# EAGLE schematic eagle 1 (EAGLE 9.2.0)
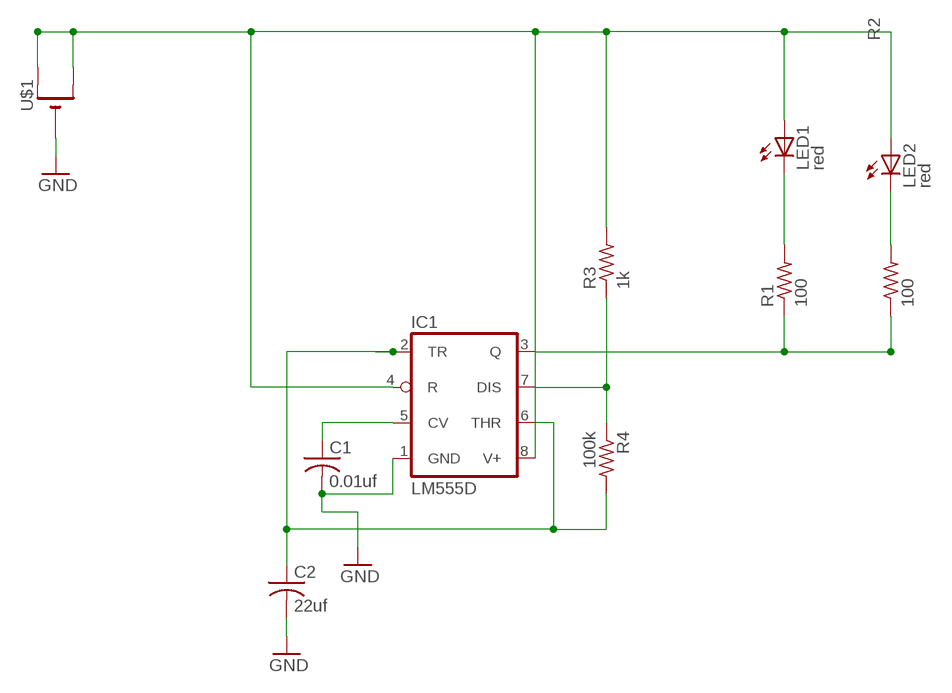
[diagram p0: schematic, sheet 1]

## Parts
C1  0.01uf  C-USC0805  [C0805]
C2  22uf  C-USC0805  [C0805]
IC1  LM555D  [SO08]
LED1  red  LEDCHIPLED_0805  [CHIPLED_0805]
LED2  red  LEDCHIPLED_0805  [CHIPLED_0805]
R1  100  R-US_R0805  [R0805]
R2  100  R-US_R0805  [R0805]
R3  1k  R-US_R0805  [R0805]
R4  100k  R-US_R0805  [R0805]
U$1  CR1220SMT  [CR1220-SMD]

## Nets
GND: C1.2 C2.2 IC1.1(GND) U$1.-
N$1: LED1.C R1.2
N$2: LED2.C R2.2
N$3: IC1.3(Q) R1.1 R2.1
N$5: IC1.7(DIS) R3.1 R4.1
N$6: C1.1 IC1.5(CV)
N$8: C2.1 IC1.2(TR) IC1.6(THR) R4.2
N$9: IC1.4(R) IC1.8(V+) LED1.A LED2.A R3.2 U$1.+$1(+) U$1.+$2(+1)

## Library data of the parts
C1 C2 = adafruit:C-US: CAPACITOR, American symbol
IC1 = adafruit:*555: TIMER Changed DIP package to have round (not oval) pin pads http://www.ladyada.net/library/pcb/eaglelibrary.html
LED1 LED2 = adafruit:LED: LED OSRAM: - CHIPLED LG R971, LG N971, LY N971, LG Q971, LY Q971, LO R971, LY R971 LH N974, LH R974 LS Q976, LO Q976, LY Q976 LO Q996 - Hyper CHIPLED LW Q18S LB Q993, LB Q99A, LB R99A - SideLED LS A670, LO A670, LY A670, LG A670, LP A670 LB A673, LV A673, LT A673, LW A673 LH A674 LY A675 LS A676, LA A676, LO A676, LY A676, LW A676 LS A679, LY A679, LG A679 - Hyper Micro SIDELED® LS Y876, LA Y876, LO Y876, LY Y876 LT Y87S - SmartLED LW L88C, LW L88S LB L89C, LB L89S, LG L890 LS L89K, LO L89K, LY L89K LS L896, LA L896, LO L896, LY L896 - TOPLED LS T670, LO T670, LY T670, LG T670, LP T670 LSG T670, LSP T670, LSY T670, LOP T670, LYG T670 LG T671, LOG T671, LSG T671 LB T673, LV T673, LT T673, LW T673 LH T674 LS T676, LA T676, LO T676, LY T676, LB T676, LH T676, LSB T676, LW T676 LB T67C, LV T67C, LT T67C, LS T67K, LO T67K, LY T67K, LW E67C LS E67B, LA E67B, LO E67B, LY E67B, LB E67C, LV E67C, LT E67C LW T67C LS T679, LY T679, LG T679 LS T770, LO T770, LY T770, LG T770, LP T770 LB T773, LV T773, LT T773, LW T773 LH T774 LS E675, LA E675, LY E675, LS T675 LS T776, LA T776, LO T776, LY T776, LB T776 LHGB T686 LT T68C, LB T68C - Hyper Mini TOPLED® LB M676 - Mini TOPLED Santana® LG M470 LS M47K, LO M47K, LY M47K Source: http://www.osram.convergy.de/
R1-R4 = adafruit:R-US_: RESISTOR, American symbol
U$1 = adafruit:CR1220: CR1216/CR1220/CR1225 12mm 3V lithium coin cell Great for battery packup. Both SMT and THM holders. Note the THM package has the ground pads on both sides of the PCB so that the masks are the same - this reduces the cost

## Net classes
0 default: width 0.305 mm, drill 0.508 mm, clearance 0.254 mm